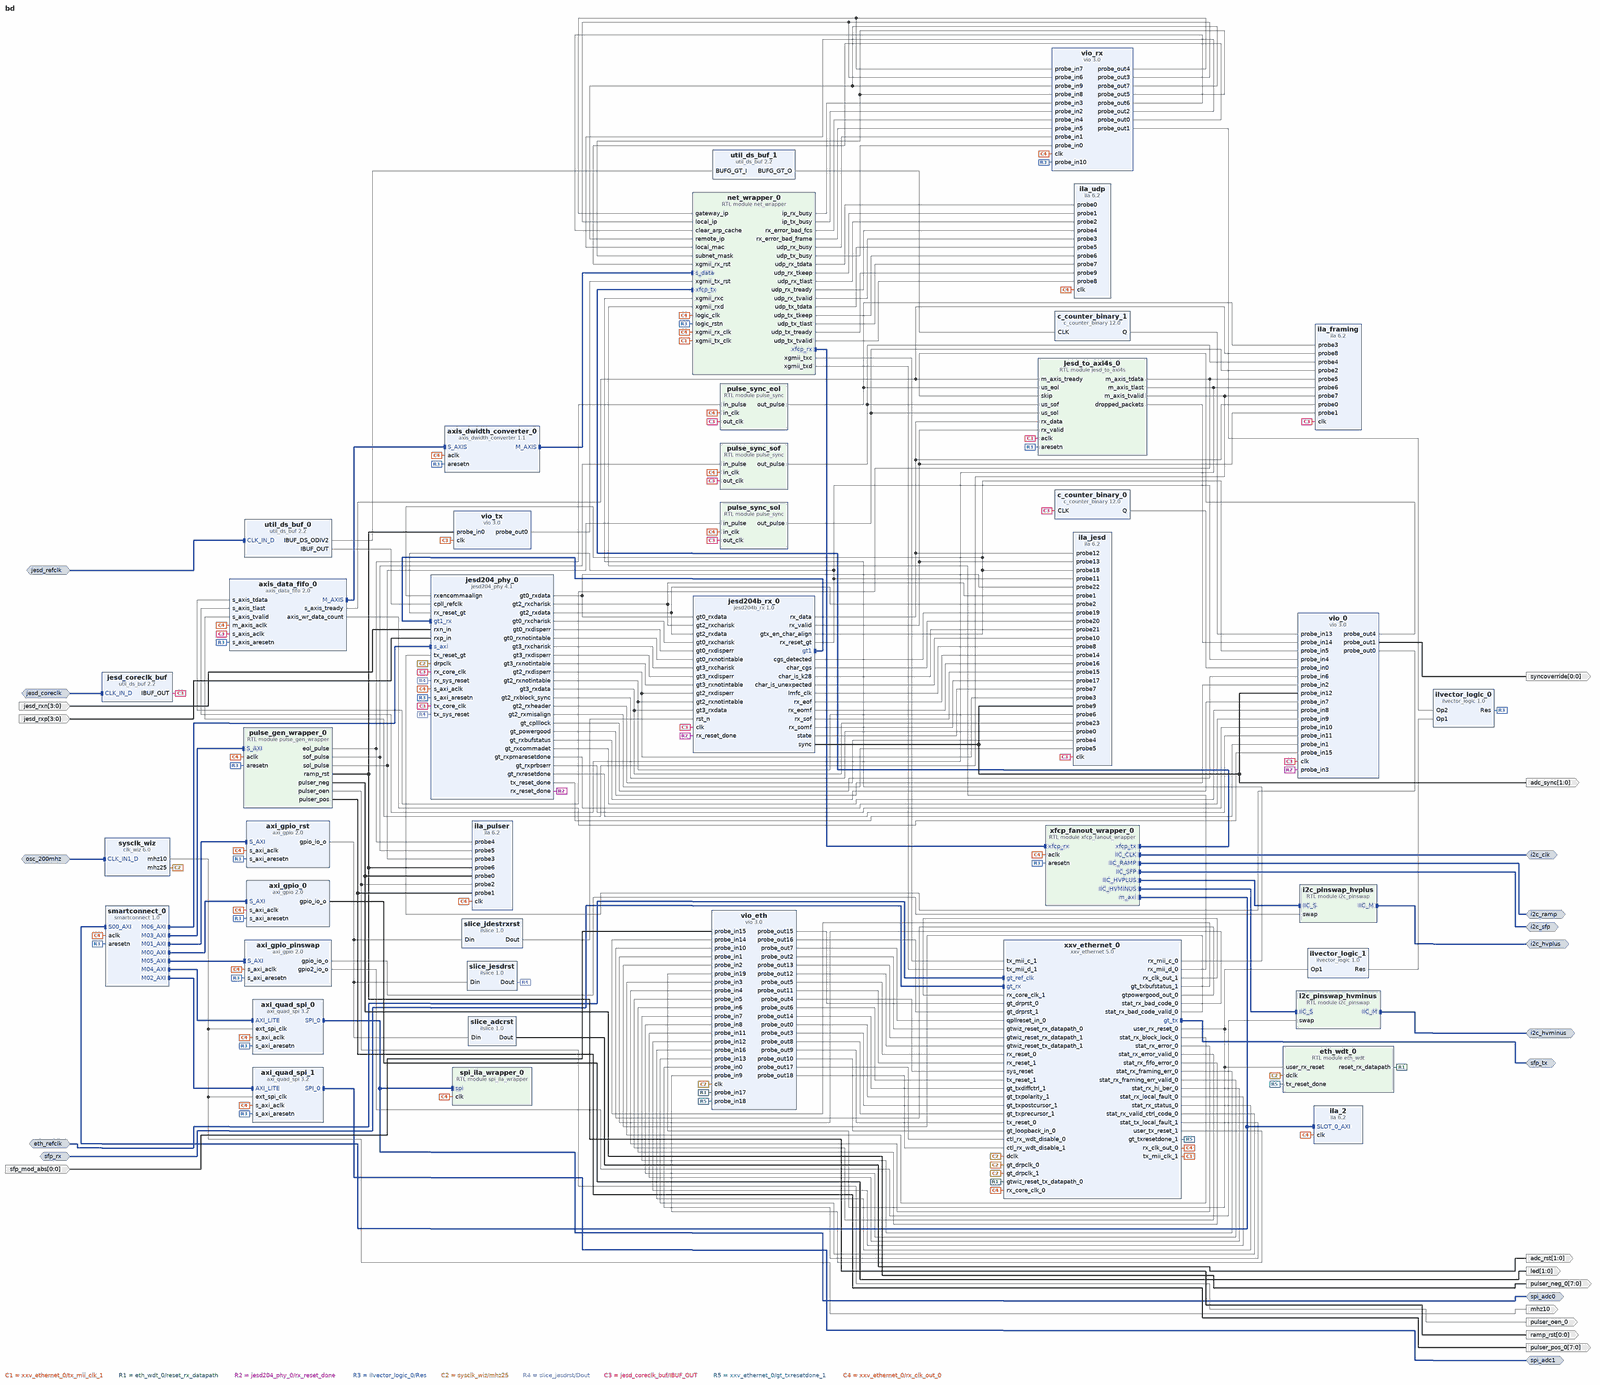
[diagram p0: block diagram of the top level, whole]
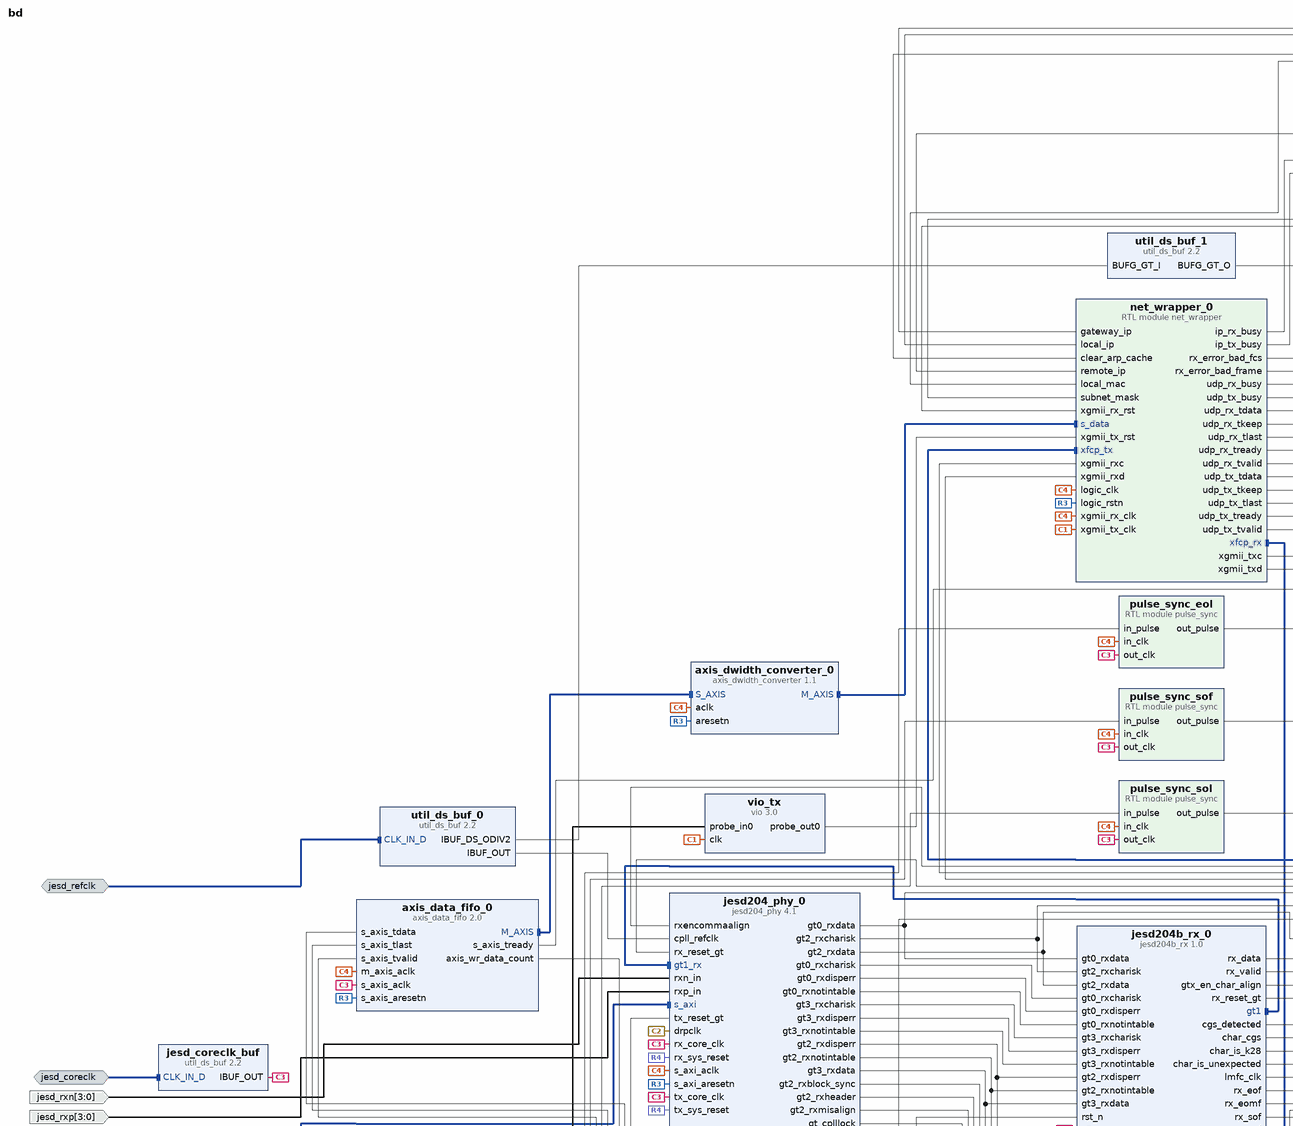
[diagram p1: block diagram of the top level, upper left part]
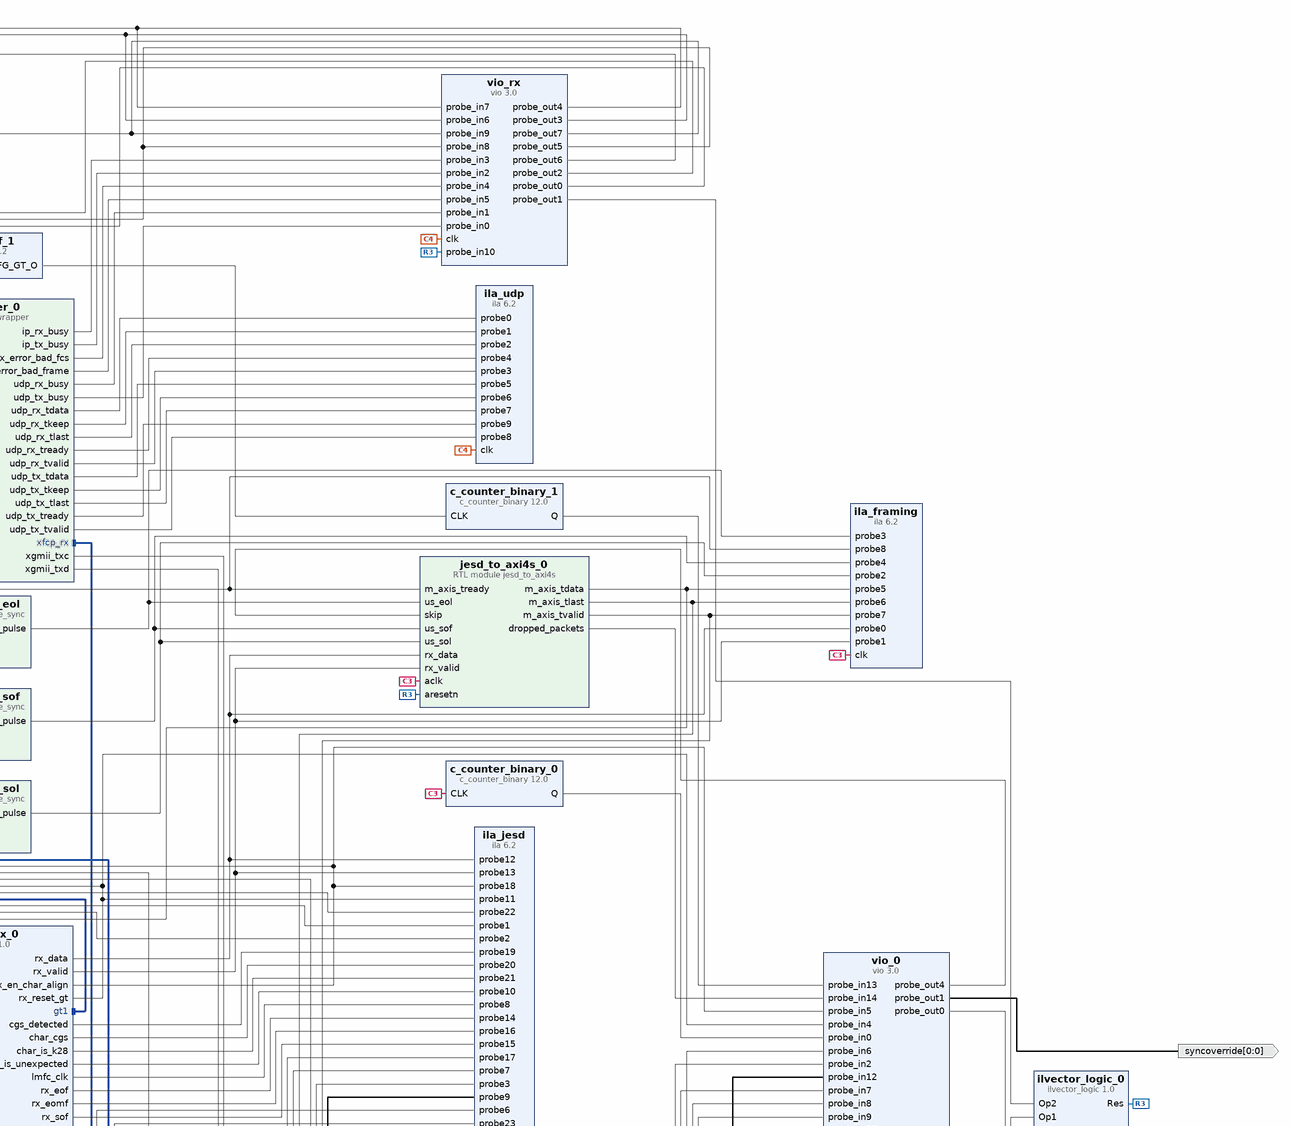
[diagram p2: block diagram of the top level, upper right part]
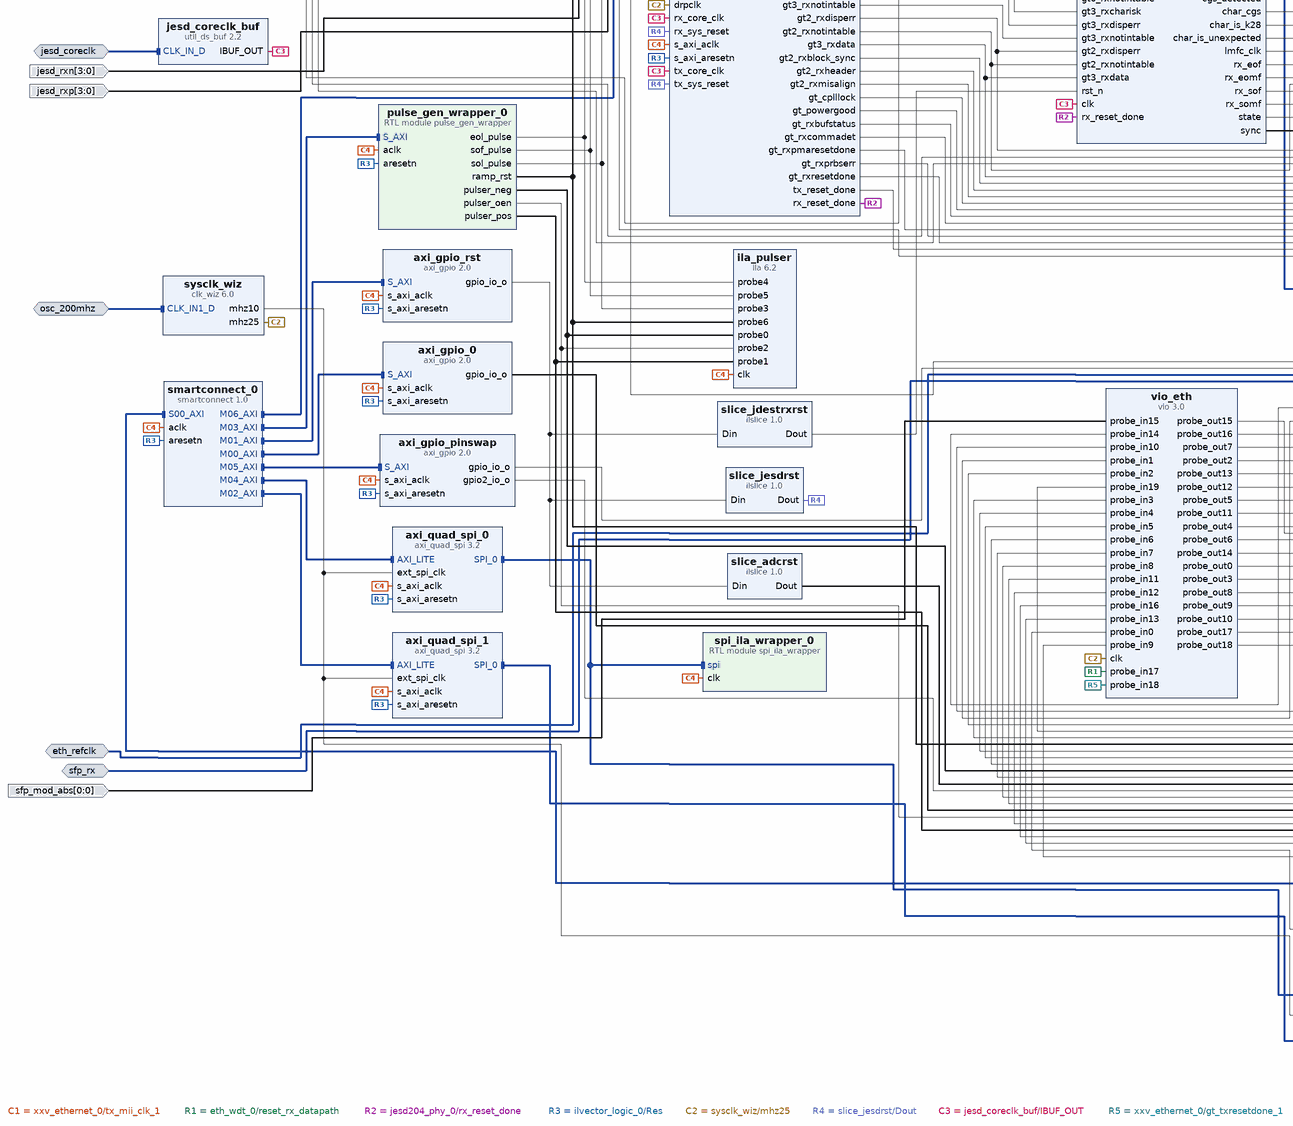
[diagram p3: block diagram of the top level, lower left part]
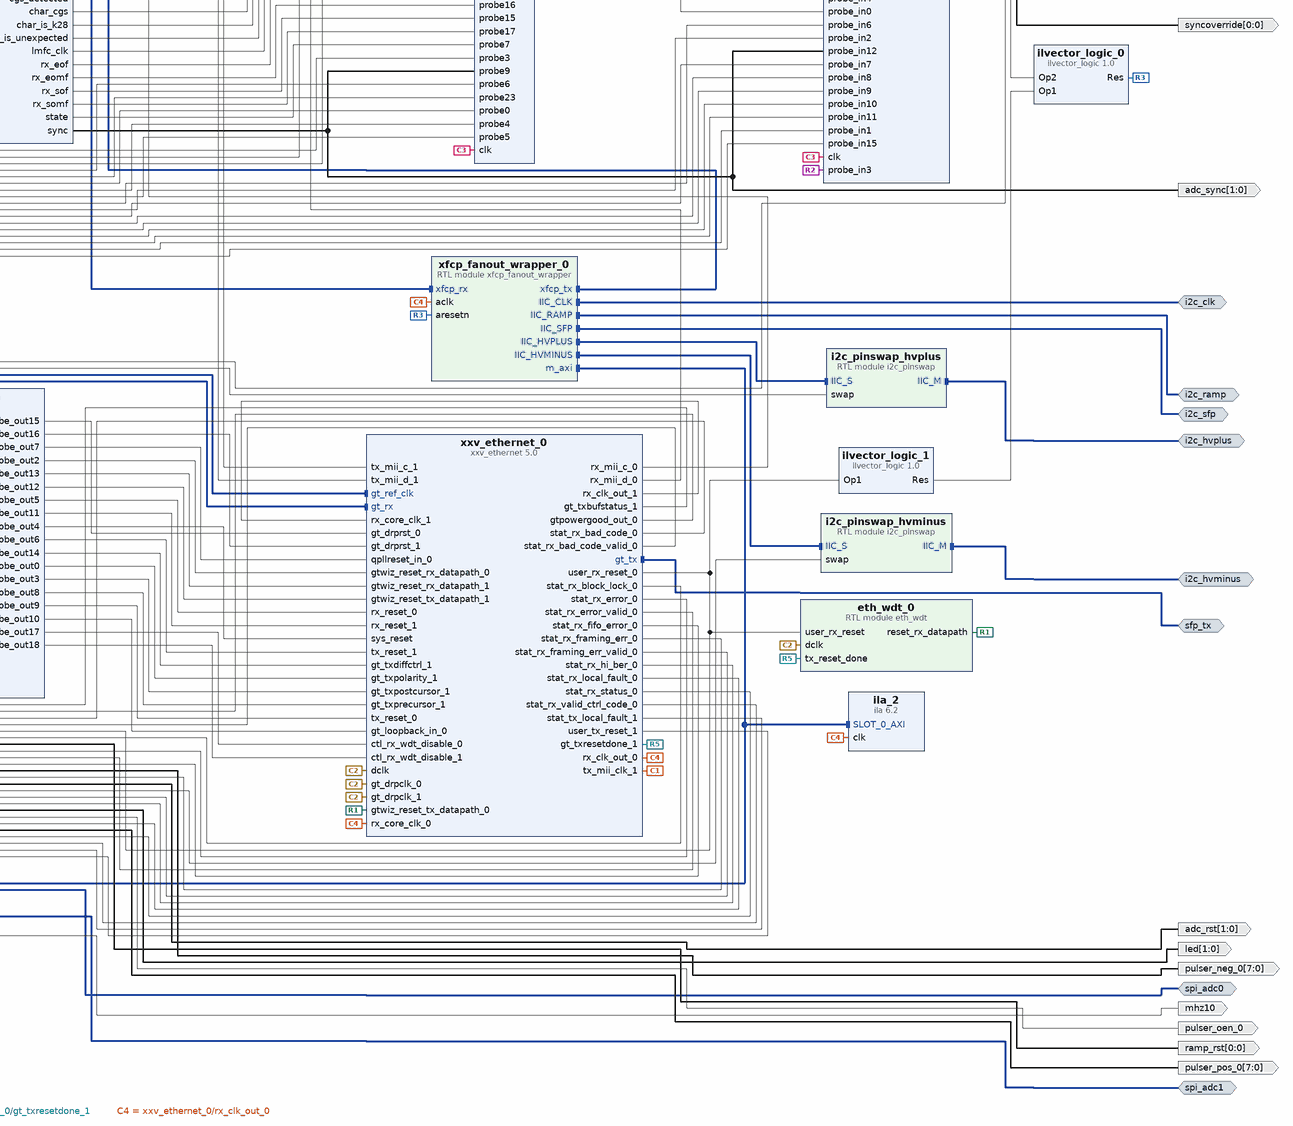
[diagram p4: block diagram of the top level, lower right part]
# Vivado block design bd, xcau15p-ffvb676-2-i, Vivado 2025.2.1
create_bd_design bd

create_bd_intf_port -mode Slave -vlnv xilinx.com:interface:diff_clock_rtl:1.0 eth_refclk
set_property -dict {CONFIG.FREQ_HZ 156250000} [get_bd_intf_ports eth_refclk]
create_bd_intf_port -mode Slave -vlnv xilinx.com:display_xxv_ethernet:gt_ports:2.0 sfp_rx
create_bd_intf_port -mode Master -vlnv xilinx.com:display_xxv_ethernet:gt_ports:2.0 sfp_tx
create_bd_intf_port -mode Slave -vlnv xilinx.com:interface:diff_clock_rtl:1.0 jesd_refclk
create_bd_intf_port -mode Slave -vlnv xilinx.com:interface:diff_clock_rtl:1.0 osc_200mhz
set_property -dict {CONFIG.FREQ_HZ 200000000} [get_bd_intf_ports osc_200mhz]
create_bd_intf_port -mode Slave -vlnv xilinx.com:interface:diff_clock_rtl:1.0 jesd_coreclk
create_bd_intf_port -mode Master -vlnv xilinx.com:interface:iic_rtl:1.0 i2c_hvplus
create_bd_intf_port -mode Master -vlnv xilinx.com:interface:iic_rtl:1.0 i2c_hvminus
create_bd_intf_port -mode Master -vlnv xilinx.com:interface:iic_rtl:1.0 i2c_clk
create_bd_intf_port -mode Master -vlnv xilinx.com:interface:iic_rtl:1.0 i2c_sfp
create_bd_intf_port -mode Master -vlnv xilinx.com:interface:iic_rtl:1.0 i2c_ramp
create_bd_intf_port -mode Master -vlnv xilinx.com:interface:spi_rtl:1.0 spi_adc0
create_bd_intf_port -mode Master -vlnv xilinx.com:interface:spi_rtl:1.0 spi_adc1
create_bd_port -dir I -from 3 -to 0 jesd_rxp
create_bd_port -dir I -from 3 -to 0 jesd_rxn
create_bd_port -dir I -from 0 -to 0 sfp_mod_abs
create_bd_port -dir O -from 1 -to 0 led
create_bd_port -dir O -from 0 -to 0 ramp_rst
create_bd_port -dir O -from 7 -to 0 pulser_pos_0
create_bd_port -dir O -from 7 -to 0 pulser_neg_0
create_bd_port -dir O pulser_oen_0
create_bd_port -dir O -from 1 -to 0 adc_sync
create_bd_port -dir O -from 1 -to 0 adc_rst
create_bd_port -dir O -type clk mhz10
create_bd_port -dir O -from 0 -to 0 syncoverride

create_bd_cell -type ip -vlnv xilinx.com:ip:xxv_ethernet:5.0 xxv_ethernet_0
set_property -dict [list \
  CONFIG.ADD_GT_CNTRL_STS_PORTS 1 \
  CONFIG.BASE_R_KR BASE-R \
  CONFIG.CORE {Ethernet PCS/PMA 64-bit} \
  CONFIG.DATA_PATH_INTERFACE MII \
  CONFIG.ENABLE_GT_BOARD_INTERFACE 0 \
  CONFIG.ENABLE_PIPELINE_REG 0 \
  CONFIG.GT_DRP_CLK 25 \
  CONFIG.INCLUDE_AXI4_INTERFACE 0 \
  CONFIG.LANE1_GT_LOC X0Y0 \
  CONFIG.NUM_OF_CORES 2 \
] [get_bd_cells xxv_ethernet_0]
create_bd_cell -type ip -vlnv xilinx.com:ip:jesd204_phy:4.1 jesd204_phy_0
set_property -dict [list \
  CONFIG.Axi_Lite true \
  CONFIG.C_LANES 4 \
  CONFIG.Config_Type 0 \
  CONFIG.DRPCLK_FREQ 25.0 \
  CONFIG.GT_Line_Rate 2 \
  CONFIG.GT_Location X0Y4 \
  CONFIG.GT_REFCLK_FREQ 100 \
  CONFIG.RX_GT_Line_Rate 2 \
  CONFIG.RX_GT_REFCLK_FREQ 100 \
  CONFIG.Rx_MasterChan 2 \
  CONFIG.TransceiverControl true \
] [get_bd_cells jesd204_phy_0]
create_bd_cell -type ip -vlnv xilinx.com:ip:util_ds_buf:2.2 util_ds_buf_0
set_property -dict {CONFIG.C_BUF_TYPE IBUFDSGTE} [get_bd_cells util_ds_buf_0]
create_bd_cell -type ip -vlnv xilinx.com:ip:util_ds_buf:2.2 jesd_coreclk_buf
set_property -dict {CONFIG.C_BUF_TYPE IBUFDS} [get_bd_cells jesd_coreclk_buf]
create_bd_cell -type ip -vlnv xilinx.com:ip:clk_wiz:6.0 sysclk_wiz
set_property -dict [list \
  CONFIG.AUTO_PRIMITIVE PLL \
  CONFIG.CLKIN1_JITTER_PS 50.0 \
  CONFIG.CLKOUT1_DRIVES Buffer \
  CONFIG.CLKOUT1_JITTER 151.619 \
  CONFIG.CLKOUT1_PHASE_ERROR 97.786 \
  CONFIG.CLKOUT1_REQUESTED_OUT_FREQ 25 \
  CONFIG.CLKOUT2_DRIVES Buffer \
  CONFIG.CLKOUT2_JITTER 181.846 \
  CONFIG.CLKOUT2_PHASE_ERROR 97.786 \
  CONFIG.CLKOUT2_REQUESTED_OUT_FREQ 10 \
  CONFIG.CLKOUT2_USED true \
  CONFIG.CLKOUT3_DRIVES Buffer \
  CONFIG.CLKOUT4_DRIVES Buffer \
  CONFIG.CLKOUT5_DRIVES Buffer \
  CONFIG.CLKOUT6_DRIVES Buffer \
  CONFIG.CLKOUT7_DRIVES Buffer \
  CONFIG.CLK_OUT1_PORT mhz25 \
  CONFIG.CLK_OUT2_PORT mhz10 \
  CONFIG.FEEDBACK_SOURCE FDBK_AUTO \
  CONFIG.MMCM_BANDWIDTH OPTIMIZED \
  CONFIG.MMCM_CLKFBOUT_MULT_F 4 \
  CONFIG.MMCM_CLKIN1_PERIOD 5.000 \
  CONFIG.MMCM_CLKIN2_PERIOD 10.0 \
  CONFIG.MMCM_CLKOUT0_DIVIDE_F 32 \
  CONFIG.MMCM_CLKOUT1_DIVIDE 80 \
  CONFIG.MMCM_COMPENSATION AUTO \
  CONFIG.MMCM_DIVCLK_DIVIDE 1 \
  CONFIG.NUM_OUT_CLKS 2 \
  CONFIG.OPTIMIZE_CLOCKING_STRUCTURE_EN true \
  CONFIG.PRIMITIVE Auto \
  CONFIG.PRIM_IN_FREQ 200 \
  CONFIG.PRIM_SOURCE Differential_clock_capable_pin \
  CONFIG.USE_LOCKED false \
  CONFIG.USE_RESET false \
] [get_bd_cells sysclk_wiz]
create_bd_cell -type ip -vlnv xilinx.com:ip:vio:3.0 vio_tx
set_property -dict [list \
  CONFIG.C_NUM_PROBE_IN 1 \
  CONFIG.C_NUM_PROBE_OUT 1 \
  CONFIG.C_PROBE_IN0_WIDTH 1 \
  CONFIG.C_PROBE_IN1_WIDTH 1 \
  CONFIG.C_PROBE_OUT0_WIDTH 1 \
  CONFIG.C_PROBE_OUT1_INIT_VAL 0x1 \
  CONFIG.C_PROBE_OUT2_WIDTH 8 \
  CONFIG.C_PROBE_OUT3_INIT_VAL 0x0 \
] [get_bd_cells vio_tx]
create_bd_cell -type ip -vlnv xilinx.com:ip:vio:3.0 vio_rx
set_property -dict [list \
  CONFIG.C_NUM_PROBE_IN 11 \
  CONFIG.C_NUM_PROBE_OUT 8 \
  CONFIG.C_PROBE_IN0_WIDTH 1 \
  CONFIG.C_PROBE_IN10_WIDTH 1 \
  CONFIG.C_PROBE_IN11_WIDTH 8 \
  CONFIG.C_PROBE_IN12_WIDTH 8 \
  CONFIG.C_PROBE_IN13_WIDTH 16 \
  CONFIG.C_PROBE_IN14_WIDTH 32 \
  CONFIG.C_PROBE_IN15_WIDTH 32 \
  CONFIG.C_PROBE_IN16_WIDTH 16 \
  CONFIG.C_PROBE_IN17_WIDTH 16 \
  CONFIG.C_PROBE_IN18_WIDTH 16 \
  CONFIG.C_PROBE_IN19_WIDTH 16 \
  CONFIG.C_PROBE_IN1_WIDTH 1 \
  CONFIG.C_PROBE_IN2_WIDTH 1 \
  CONFIG.C_PROBE_IN3_WIDTH 1 \
  CONFIG.C_PROBE_IN4_WIDTH 1 \
  CONFIG.C_PROBE_IN5_WIDTH 1 \
  CONFIG.C_PROBE_IN6_WIDTH 32 \
  CONFIG.C_PROBE_IN7_WIDTH 32 \
  CONFIG.C_PROBE_IN8_WIDTH 32 \
  CONFIG.C_PROBE_IN9_WIDTH 32 \
  CONFIG.C_PROBE_OUT0_WIDTH 1 \
  CONFIG.C_PROBE_OUT10_WIDTH 1 \
  CONFIG.C_PROBE_OUT11_WIDTH 16 \
  CONFIG.C_PROBE_OUT13_WIDTH 1 \
  CONFIG.C_PROBE_OUT1_INIT_VAL 0x1 \
  CONFIG.C_PROBE_OUT1_WIDTH 1 \
  CONFIG.C_PROBE_OUT2_INIT_VAL 0x020000000001 \
  CONFIG.C_PROBE_OUT2_WIDTH 48 \
  CONFIG.C_PROBE_OUT3_INIT_VAL 0x0a500401 \
  CONFIG.C_PROBE_OUT3_WIDTH 32 \
  CONFIG.C_PROBE_OUT4_INIT_VAL 0x00000000 \
  CONFIG.C_PROBE_OUT4_WIDTH 32 \
  CONFIG.C_PROBE_OUT5_INIT_VAL 0x00000000 \
  CONFIG.C_PROBE_OUT5_WIDTH 32 \
  CONFIG.C_PROBE_OUT6_WIDTH 1 \
  CONFIG.C_PROBE_OUT7_INIT_VAL 0x0a500402 \
  CONFIG.C_PROBE_OUT7_WIDTH 32 \
  CONFIG.C_PROBE_OUT8_WIDTH 16 \
  CONFIG.C_PROBE_OUT9_WIDTH 16 \
] [get_bd_cells vio_rx]
create_bd_cell -type ip -vlnv xilinx.com:ip:vio:3.0 vio_eth
set_property -dict [list \
  CONFIG.C_NUM_PROBE_IN 20 \
  CONFIG.C_NUM_PROBE_OUT 19 \
  CONFIG.C_PROBE_IN17_WIDTH 16 \
  CONFIG.C_PROBE_IN18_WIDTH 16 \
  CONFIG.C_PROBE_IN20_WIDTH 2 \
  CONFIG.C_PROBE_IN4_WIDTH 8 \
  CONFIG.C_PROBE_OUT0_INIT_VAL 0x1 \
  CONFIG.C_PROBE_OUT10_WIDTH 3 \
  CONFIG.C_PROBE_OUT11_INIT_VAL 0x0 \
  CONFIG.C_PROBE_OUT11_WIDTH 1 \
  CONFIG.C_PROBE_OUT12_INIT_VAL 0x0 \
  CONFIG.C_PROBE_OUT12_WIDTH 1 \
  CONFIG.C_PROBE_OUT13_INIT_VAL 0x1 \
  CONFIG.C_PROBE_OUT13_WIDTH 1 \
  CONFIG.C_PROBE_OUT14_INIT_VAL 0x10 \
  CONFIG.C_PROBE_OUT14_WIDTH 5 \
  CONFIG.C_PROBE_OUT17_INIT_VAL 0x1 \
  CONFIG.C_PROBE_OUT1_INIT_VAL 0x1 \
  CONFIG.C_PROBE_OUT3_WIDTH 5 \
  CONFIG.C_PROBE_OUT8_WIDTH 5 \
  CONFIG.C_PROBE_OUT9_INIT_VAL 0x1 \
] [get_bd_cells vio_eth]
create_bd_cell -type module -reference net_wrapper net_wrapper_0
create_bd_cell -type ip -vlnv xilinx.com:ip:axi_gpio:2.0 axi_gpio_0
set_property -dict {CONFIG.C_ALL_OUTPUTS 1 CONFIG.C_GPIO_WIDTH 2} [get_bd_cells axi_gpio_0]
create_bd_cell -type ip -vlnv xilinx.com:ip:smartconnect:1.0 smartconnect_0
set_property -dict {CONFIG.NUM_MI 7 CONFIG.NUM_SI 1} [get_bd_cells smartconnect_0]
create_bd_cell -type ip -vlnv xilinx.com:ip:ila:6.2 ila_2
create_bd_cell -type module -reference xfcp_fanout_wrapper xfcp_fanout_wrapper_0
create_bd_cell -type ip -vlnv xilinx.com:ip:axi_gpio:2.0 axi_gpio_rst
set_property -dict {CONFIG.C_ALL_OUTPUTS 1 CONFIG.C_DOUT_DEFAULT 0x00000008 CONFIG.C_GPIO_WIDTH 4} [get_bd_cells axi_gpio_rst]
create_bd_cell -type module -reference pulse_gen_wrapper pulse_gen_wrapper_0
create_bd_cell -type ip -vlnv xilinx.com:user:jesd204b_rx:1.0 jesd204b_rx_0
set_property -dict {CONFIG.DATA_WIDTH 32 CONFIG.K 9 CONFIG.L 4 CONFIG.LINKS 2} [get_bd_cells jesd204b_rx_0]
create_bd_cell -type ip -vlnv xilinx.com:ip:c_counter_binary:12.0 c_counter_binary_0
set_property -dict {CONFIG.Output_Width 32} [get_bd_cells c_counter_binary_0]
create_bd_cell -type ip -vlnv xilinx.com:ip:vio:3.0 vio_0
set_property -dict [list \
  CONFIG.C_NUM_PROBE_IN 16 \
  CONFIG.C_NUM_PROBE_OUT 5 \
  CONFIG.C_PROBE_IN0_WIDTH 32 \
  CONFIG.C_PROBE_IN10_WIDTH 4 \
  CONFIG.C_PROBE_IN11_WIDTH 4 \
  CONFIG.C_PROBE_IN12_WIDTH 2 \
  CONFIG.C_PROBE_IN13_WIDTH 32 \
  CONFIG.C_PROBE_IN14_WIDTH 32 \
  CONFIG.C_PROBE_IN15_WIDTH 32 \
  CONFIG.C_PROBE_IN4_WIDTH 1 \
  CONFIG.C_PROBE_IN6_WIDTH 4 \
  CONFIG.C_PROBE_IN7_WIDTH 12 \
  CONFIG.C_PROBE_IN8_WIDTH 4 \
  CONFIG.C_PROBE_IN9_WIDTH 4 \
  CONFIG.C_PROBE_OUT4_INIT_VAL 0x00 \
  CONFIG.C_PROBE_OUT4_WIDTH 8 \
  CONFIG.C_PROBE_OUT6_INIT_VAL 0xf \
  CONFIG.C_PROBE_OUT6_WIDTH 4 \
] [get_bd_cells vio_0]
create_bd_cell -type ip -vlnv xilinx.com:ip:axi_quad_spi:3.2 axi_quad_spi_0
create_bd_cell -type ip -vlnv xilinx.com:ip:axi_quad_spi:3.2 axi_quad_spi_1
create_bd_cell -type ip -vlnv xilinx.com:ip:ila:6.2 ila_jesd
set_property -dict [list \
  CONFIG.C_MONITOR_TYPE Native \
  CONFIG.C_NUM_OF_PROBES 24 \
  CONFIG.C_PROBE10_WIDTH 16 \
  CONFIG.C_PROBE12_WIDTH 128 \
  CONFIG.C_PROBE14_WIDTH 4 \
  CONFIG.C_PROBE15_WIDTH 4 \
  CONFIG.C_PROBE16_WIDTH 4 \
  CONFIG.C_PROBE17_WIDTH 4 \
  CONFIG.C_PROBE19_WIDTH 4 \
  CONFIG.C_PROBE1_WIDTH 4 \
  CONFIG.C_PROBE20_WIDTH 16 \
  CONFIG.C_PROBE21_WIDTH 16 \
  CONFIG.C_PROBE22_WIDTH 32 \
  CONFIG.C_PROBE23_WIDTH 32 \
  CONFIG.C_PROBE2_WIDTH 64 \
  CONFIG.C_PROBE3_WIDTH 4 \
  CONFIG.C_PROBE4_WIDTH 2 \
  CONFIG.C_PROBE6_WIDTH 4 \
  CONFIG.C_PROBE7_WIDTH 2 \
  CONFIG.C_PROBE8_WIDTH 1 \
  CONFIG.C_PROBE9_WIDTH 2 \
] [get_bd_cells ila_jesd]
create_bd_cell -type module -reference i2c_pinswap i2c_pinswap_hvplus
create_bd_cell -type module -reference i2c_pinswap i2c_pinswap_hvminus
create_bd_cell -type ip -vlnv xilinx.com:ip:axi_gpio:2.0 axi_gpio_pinswap
set_property -dict [list \
  CONFIG.C_ALL_OUTPUTS 1 \
  CONFIG.C_ALL_OUTPUTS_2 1 \
  CONFIG.C_GPIO2_WIDTH 1 \
  CONFIG.C_GPIO_WIDTH 1 \
  CONFIG.C_IS_DUAL 1 \
] [get_bd_cells axi_gpio_pinswap]
create_bd_cell -type inline_hdl -vlnv xilinx.com:inline_hdl:ilvector_logic:1.0 ilvector_logic_0
set_property -dict {CONFIG.C_OPERATION and CONFIG.C_SIZE 1} [get_bd_cells ilvector_logic_0]
create_bd_cell -type inline_hdl -vlnv xilinx.com:inline_hdl:ilvector_logic:1.0 ilvector_logic_1
set_property -dict {CONFIG.C_OPERATION not CONFIG.C_SIZE 1} [get_bd_cells ilvector_logic_1]
create_bd_cell -type module -reference eth_wdt eth_wdt_0
create_bd_cell -type ip -vlnv xilinx.com:ip:util_ds_buf:2.2 util_ds_buf_1
set_property -dict {CONFIG.C_BUF_TYPE BUFG_GT} [get_bd_cells util_ds_buf_1]
create_bd_cell -type ip -vlnv xilinx.com:ip:c_counter_binary:12.0 c_counter_binary_1
set_property -dict {CONFIG.Output_Width 32} [get_bd_cells c_counter_binary_1]
create_bd_cell -type inline_hdl -vlnv xilinx.com:inline_hdl:ilslice:1.0 slice_adcrst
set_property -dict {CONFIG.DIN_FROM 1 CONFIG.DIN_WIDTH 4} [get_bd_cells slice_adcrst]
create_bd_cell -type inline_hdl -vlnv xilinx.com:inline_hdl:ilslice:1.0 slice_jesdrst
set_property -dict {CONFIG.DIN_FROM 2 CONFIG.DIN_TO 2 CONFIG.DIN_WIDTH 4} [get_bd_cells slice_jesdrst]
create_bd_cell -type module -reference spi_ila_wrapper spi_ila_wrapper_0
create_bd_cell -type ip -vlnv xilinx.com:ip:axis_data_fifo:2.0 axis_data_fifo_0
set_property -dict [list \
  CONFIG.FIFO_DEPTH 1024 \
  CONFIG.HAS_RD_DATA_COUNT 0 \
  CONFIG.HAS_TKEEP 0 \
  CONFIG.HAS_WR_DATA_COUNT 1 \
  CONFIG.IS_ACLK_ASYNC 1 \
] [get_bd_cells axis_data_fifo_0]
create_bd_cell -type module -reference jesd_to_axi4s jesd_to_axi4s_0
set_property -dict {CONFIG.FRAMES_PER_PACKET 80} [get_bd_cells jesd_to_axi4s_0]
create_bd_cell -type ip -vlnv xilinx.com:ip:ila:6.2 ila_udp
set_property -dict [list \
  CONFIG.C_MONITOR_TYPE Native \
  CONFIG.C_NUM_OF_PROBES 10 \
  CONFIG.C_PROBE0_WIDTH 64 \
  CONFIG.C_PROBE1_WIDTH 8 \
  CONFIG.C_PROBE5_WIDTH 64 \
  CONFIG.C_PROBE6_WIDTH 8 \
] [get_bd_cells ila_udp]
create_bd_cell -type ip -vlnv xilinx.com:ip:axis_dwidth_converter:1.1 axis_dwidth_converter_0
set_property -dict {CONFIG.M_TDATA_NUM_BYTES 8} [get_bd_cells axis_dwidth_converter_0]
create_bd_cell -type inline_hdl -vlnv xilinx.com:inline_hdl:ilslice:1.0 slice_jdestrxrst
set_property -dict {CONFIG.DIN_FROM 3 CONFIG.DIN_TO 3 CONFIG.DIN_WIDTH 4} [get_bd_cells slice_jdestrxrst]
create_bd_cell -type module -reference pulse_sync pulse_sync_sol
create_bd_cell -type module -reference pulse_sync pulse_sync_sof
create_bd_cell -type module -reference pulse_sync pulse_sync_eol
create_bd_cell -type ip -vlnv xilinx.com:ip:ila:6.2 ila_framing
set_property -dict [list \
  CONFIG.C_MONITOR_TYPE Native \
  CONFIG.C_NUM_OF_PROBES 9 \
  CONFIG.C_PROBE0_WIDTH 128 \
  CONFIG.C_PROBE5_WIDTH 128 \
] [get_bd_cells ila_framing]
create_bd_cell -type ip -vlnv xilinx.com:ip:ila:6.2 ila_pulser
set_property -dict [list \
  CONFIG.C_ADV_TRIGGER true \
  CONFIG.C_EN_STRG_QUAL 1 \
  CONFIG.C_MONITOR_TYPE Native \
  CONFIG.C_NUM_OF_PROBES 7 \
  CONFIG.C_PROBE0_WIDTH 8 \
  CONFIG.C_PROBE1_WIDTH 8 \
] [get_bd_cells ila_pulser]

# ---- connections ----

connect_bd_intf_net -intf_net CLK_IN1_D_0_1 [get_bd_intf_ports osc_200mhz] [get_bd_intf_pins sysclk_wiz/CLK_IN1_D]
connect_bd_intf_net -intf_net CLK_IN_D_0_1 [get_bd_intf_ports jesd_refclk] [get_bd_intf_pins util_ds_buf_0/CLK_IN_D]
connect_bd_intf_net -intf_net CLK_IN_D_0_2 [get_bd_intf_ports jesd_coreclk] [get_bd_intf_pins jesd_coreclk_buf/CLK_IN_D]
connect_bd_intf_net [get_bd_intf_ports spi_adc0] [get_bd_intf_pins axi_quad_spi_0/SPI_0]
connect_bd_intf_net [get_bd_intf_ports spi_adc0] [get_bd_intf_pins spi_ila_wrapper_0/spi]
connect_bd_intf_net [get_bd_intf_ports spi_adc1] [get_bd_intf_pins axi_quad_spi_1/SPI_0]
connect_bd_intf_net [get_bd_intf_pins axis_dwidth_converter_0/S_AXIS] [get_bd_intf_pins axis_data_fifo_0/M_AXIS]
connect_bd_intf_net [get_bd_intf_pins axis_dwidth_converter_0/M_AXIS] [get_bd_intf_pins net_wrapper_0/s_data]
connect_bd_intf_net -intf_net gt_ref_clk_0_1 [get_bd_intf_ports eth_refclk] [get_bd_intf_pins xxv_ethernet_0/gt_ref_clk]
connect_bd_intf_net -intf_net gt_rx_0_1 [get_bd_intf_ports sfp_rx] [get_bd_intf_pins xxv_ethernet_0/gt_rx]
connect_bd_intf_net -intf_net i2c_pinswap_0_IIC_M [get_bd_intf_ports i2c_hvplus] [get_bd_intf_pins i2c_pinswap_hvplus/IIC_M]
connect_bd_intf_net -intf_net i2c_pinswap_1_IIC_M [get_bd_intf_ports i2c_hvminus] [get_bd_intf_pins i2c_pinswap_hvminus/IIC_M]
connect_bd_intf_net [get_bd_intf_pins jesd204b_rx_0/gt1] [get_bd_intf_pins jesd204_phy_0/gt1_rx]
connect_bd_intf_net [get_bd_intf_pins net_wrapper_0/xfcp_rx] [get_bd_intf_pins xfcp_fanout_wrapper_0/xfcp_rx]
connect_bd_intf_net [get_bd_intf_pins smartconnect_0/M00_AXI] [get_bd_intf_pins axi_gpio_0/S_AXI]
connect_bd_intf_net [get_bd_intf_pins smartconnect_0/M01_AXI] [get_bd_intf_pins axi_gpio_rst/S_AXI]
connect_bd_intf_net [get_bd_intf_pins axi_quad_spi_1/AXI_LITE] [get_bd_intf_pins smartconnect_0/M02_AXI]
connect_bd_intf_net [get_bd_intf_pins pulse_gen_wrapper_0/S_AXI] [get_bd_intf_pins smartconnect_0/M03_AXI]
connect_bd_intf_net [get_bd_intf_pins smartconnect_0/M04_AXI] [get_bd_intf_pins axi_quad_spi_0/AXI_LITE]
connect_bd_intf_net [get_bd_intf_pins smartconnect_0/M05_AXI] [get_bd_intf_pins axi_gpio_pinswap/S_AXI]
connect_bd_intf_net [get_bd_intf_pins smartconnect_0/M06_AXI] [get_bd_intf_pins jesd204_phy_0/s_axi]
connect_bd_intf_net [get_bd_intf_ports i2c_clk] [get_bd_intf_pins xfcp_fanout_wrapper_0/IIC_CLK]
connect_bd_intf_net [get_bd_intf_pins i2c_pinswap_hvminus/IIC_S] [get_bd_intf_pins xfcp_fanout_wrapper_0/IIC_HVMINUS]
connect_bd_intf_net [get_bd_intf_pins i2c_pinswap_hvplus/IIC_S] [get_bd_intf_pins xfcp_fanout_wrapper_0/IIC_HVPLUS]
connect_bd_intf_net [get_bd_intf_ports i2c_ramp] [get_bd_intf_pins xfcp_fanout_wrapper_0/IIC_RAMP]
connect_bd_intf_net [get_bd_intf_ports i2c_sfp] [get_bd_intf_pins xfcp_fanout_wrapper_0/IIC_SFP]
connect_bd_intf_net [get_bd_intf_pins smartconnect_0/S00_AXI] [get_bd_intf_pins xfcp_fanout_wrapper_0/m_axi]
connect_bd_intf_net [get_bd_intf_pins smartconnect_0/S00_AXI] [get_bd_intf_pins ila_2/SLOT_0_AXI]
connect_bd_intf_net [get_bd_intf_pins net_wrapper_0/xfcp_tx] [get_bd_intf_pins xfcp_fanout_wrapper_0/xfcp_tx]
connect_bd_intf_net [get_bd_intf_ports sfp_tx] [get_bd_intf_pins xxv_ethernet_0/gt_tx]
connect_bd_net [get_bd_pins xxv_ethernet_0/tx_mii_clk_1] [get_bd_pins vio_tx/clk] [get_bd_pins net_wrapper_0/xgmii_tx_clk]
connect_bd_net [get_bd_pins axi_gpio_0/gpio_io_o] [get_bd_ports led]
connect_bd_net [get_bd_pins axi_gpio_pinswap/gpio2_io_o] [get_bd_pins i2c_pinswap_hvminus/swap]
connect_bd_net [get_bd_pins axi_gpio_pinswap/gpio_io_o] [get_bd_pins i2c_pinswap_hvplus/swap]
connect_bd_net -net axi_gpio_ramp_rst_gpio_io_o [get_bd_pins pulse_gen_wrapper_0/ramp_rst] \
  [get_bd_ports ramp_rst] [get_bd_pins vio_tx/probe_in0] [get_bd_pins ila_pulser/probe6]
connect_bd_net [get_bd_pins axi_gpio_rst/gpio_io_o] [get_bd_pins slice_adcrst/Din] [get_bd_pins slice_jesdrst/Din] [get_bd_pins slice_jdestrxrst/Din]
connect_bd_net [get_bd_pins axis_data_fifo_0/axis_wr_data_count] [get_bd_pins vio_0/probe_in15]
connect_bd_net [get_bd_pins axis_data_fifo_0/s_axis_tready] [get_bd_pins ila_framing/probe8] [get_bd_pins jesd_to_axi4s_0/m_axis_tready]
connect_bd_net [get_bd_pins c_counter_binary_0/Q] [get_bd_pins vio_0/probe_in0]
connect_bd_net [get_bd_pins c_counter_binary_1/Q] [get_bd_pins vio_0/probe_in13]
connect_bd_net -net clear_arp_cache [get_bd_pins vio_rx/probe_out6] [get_bd_pins net_wrapper_0/clear_arp_cache]
connect_bd_net -net drprst0 [get_bd_pins vio_eth/probe_out15] [get_bd_pins xxv_ethernet_0/gt_drprst_0]
connect_bd_net -net drprst1 [get_bd_pins vio_eth/probe_out16] [get_bd_pins xxv_ethernet_0/gt_drprst_1]
connect_bd_net [get_bd_pins eth_wdt_0/reset_rx_datapath] [get_bd_pins xxv_ethernet_0/gtwiz_reset_tx_datapath_0] [get_bd_pins vio_eth/probe_in17]
connect_bd_net -net ext_logic_rstn [get_bd_pins vio_rx/probe_out1] [get_bd_pins ilvector_logic_0/Op2]
connect_bd_net -net gateway_ip [get_bd_pins vio_rx/probe_out4] [get_bd_pins vio_rx/probe_in7] [get_bd_pins net_wrapper_0/gateway_ip]
connect_bd_net [get_bd_pins ilvector_logic_1/Res] [get_bd_pins ilvector_logic_0/Op1]
connect_bd_net [get_bd_pins jesd204_phy_0/gt0_rxcharisk] [get_bd_pins jesd204b_rx_0/gt0_rxcharisk]
connect_bd_net [get_bd_pins jesd204_phy_0/gt0_rxdata] [get_bd_pins jesd204b_rx_0/gt0_rxdata] [get_bd_pins ila_jesd/probe22]
connect_bd_net [get_bd_pins jesd204_phy_0/gt0_rxdisperr] [get_bd_pins jesd204b_rx_0/gt0_rxdisperr]
connect_bd_net [get_bd_pins jesd204_phy_0/gt0_rxnotintable] [get_bd_pins jesd204b_rx_0/gt0_rxnotintable]
connect_bd_net [get_bd_pins jesd204_phy_0/gt2_rxblock_sync] [get_bd_pins ila_jesd/probe0]
connect_bd_net [get_bd_pins jesd204_phy_0/gt2_rxcharisk] [get_bd_pins jesd204b_rx_0/gt2_rxcharisk] [get_bd_pins ila_jesd/probe1]
connect_bd_net [get_bd_pins jesd204_phy_0/gt2_rxdata] [get_bd_pins jesd204b_rx_0/gt2_rxdata] [get_bd_pins ila_jesd/probe2]
connect_bd_net [get_bd_pins jesd204_phy_0/gt2_rxdisperr] [get_bd_pins jesd204b_rx_0/gt2_rxdisperr] [get_bd_pins ila_jesd/probe3]
connect_bd_net [get_bd_pins jesd204_phy_0/gt2_rxheader] [get_bd_pins ila_jesd/probe4]
connect_bd_net [get_bd_pins jesd204_phy_0/gt2_rxmisalign] [get_bd_pins ila_jesd/probe5]
connect_bd_net [get_bd_pins jesd204_phy_0/gt2_rxnotintable] [get_bd_pins jesd204b_rx_0/gt2_rxnotintable] [get_bd_pins ila_jesd/probe6]
connect_bd_net [get_bd_pins jesd204_phy_0/gt3_rxcharisk] [get_bd_pins jesd204b_rx_0/gt3_rxcharisk]
connect_bd_net [get_bd_pins jesd204_phy_0/gt3_rxdata] [get_bd_pins jesd204b_rx_0/gt3_rxdata] [get_bd_pins ila_jesd/probe23]
connect_bd_net [get_bd_pins jesd204_phy_0/gt3_rxdisperr] [get_bd_pins jesd204b_rx_0/gt3_rxdisperr]
connect_bd_net [get_bd_pins jesd204_phy_0/gt3_rxnotintable] [get_bd_pins jesd204b_rx_0/gt3_rxnotintable]
connect_bd_net [get_bd_pins jesd204_phy_0/gt_cplllock] [get_bd_pins vio_0/probe_in6]
connect_bd_net [get_bd_pins jesd204_phy_0/gt_powergood] [get_bd_pins vio_0/probe_in2]
connect_bd_net [get_bd_pins jesd204_phy_0/gt_rxbufstatus] [get_bd_pins vio_0/probe_in7]
connect_bd_net [get_bd_pins jesd204_phy_0/gt_rxcommadet] [get_bd_pins vio_0/probe_in8]
connect_bd_net [get_bd_pins jesd204_phy_0/gt_rxpmaresetdone] [get_bd_pins vio_0/probe_in9]
connect_bd_net [get_bd_pins jesd204_phy_0/gt_rxprbserr] [get_bd_pins vio_0/probe_in10]
connect_bd_net [get_bd_pins jesd204_phy_0/gt_rxresetdone] [get_bd_pins vio_0/probe_in11]
connect_bd_net [get_bd_pins jesd204_phy_0/rx_reset_done] [get_bd_pins vio_0/probe_in3] [get_bd_pins jesd204b_rx_0/rx_reset_done]
connect_bd_net [get_bd_pins jesd204_phy_0/tx_reset_done] [get_bd_pins vio_0/probe_in1]
connect_bd_net [get_bd_pins jesd204b_rx_0/cgs_detected] [get_bd_pins ila_jesd/probe19]
connect_bd_net [get_bd_pins jesd204b_rx_0/char_cgs] [get_bd_pins ila_jesd/probe20]
connect_bd_net [get_bd_pins jesd204b_rx_0/char_is_k28] [get_bd_pins ila_jesd/probe21]
connect_bd_net [get_bd_pins jesd204b_rx_0/char_is_unexpected] [get_bd_pins ila_jesd/probe10]
connect_bd_net [get_bd_pins jesd204b_rx_0/gtx_en_char_align] \
  [get_bd_pins jesd204_phy_0/rxencommaalign] [get_bd_pins vio_0/probe_in5] [get_bd_pins ila_jesd/probe18]
connect_bd_net [get_bd_pins jesd204b_rx_0/lmfc_clk] [get_bd_pins ila_jesd/probe8]
connect_bd_net [get_bd_pins jesd204b_rx_0/rx_data] \
  [get_bd_pins ila_jesd/probe12] [get_bd_pins ila_framing/probe0] [get_bd_pins jesd_to_axi4s_0/rx_data]
connect_bd_net [get_bd_pins jesd204b_rx_0/rx_eof] [get_bd_pins ila_jesd/probe14]
connect_bd_net [get_bd_pins jesd204b_rx_0/rx_eomf] [get_bd_pins ila_jesd/probe16]
connect_bd_net [get_bd_pins jesd204b_rx_0/rx_sof] [get_bd_pins ila_jesd/probe15]
connect_bd_net [get_bd_pins jesd204b_rx_0/rx_somf] [get_bd_pins ila_jesd/probe17]
connect_bd_net [get_bd_pins jesd204b_rx_0/rx_valid] \
  [get_bd_pins ila_jesd/probe13] [get_bd_pins ila_framing/probe1] [get_bd_pins jesd_to_axi4s_0/rx_valid]
connect_bd_net [get_bd_pins jesd204b_rx_0/state] [get_bd_pins ila_jesd/probe7]
connect_bd_net [get_bd_pins jesd204b_rx_0/sync] [get_bd_pins vio_0/probe_in12] [get_bd_ports adc_sync] [get_bd_pins ila_jesd/probe9]
connect_bd_net [get_bd_pins jesd_to_axi4s_0/dropped_packets] [get_bd_pins vio_0/probe_in14]
connect_bd_net [get_bd_pins jesd_to_axi4s_0/m_axis_tdata] [get_bd_pins axis_data_fifo_0/s_axis_tdata] [get_bd_pins ila_framing/probe5]
connect_bd_net [get_bd_pins jesd_to_axi4s_0/m_axis_tlast] [get_bd_pins axis_data_fifo_0/s_axis_tlast] [get_bd_pins ila_framing/probe6]
connect_bd_net [get_bd_pins jesd_to_axi4s_0/m_axis_tvalid] [get_bd_pins axis_data_fifo_0/s_axis_tvalid] [get_bd_pins ila_framing/probe7]
connect_bd_net -net local_ip [get_bd_pins vio_rx/probe_out3] [get_bd_pins vio_rx/probe_in6] [get_bd_pins net_wrapper_0/local_ip]
connect_bd_net -net local_mac [get_bd_pins vio_rx/probe_out2] [get_bd_pins net_wrapper_0/local_mac]
connect_bd_net -net logic_rstn [get_bd_pins ilvector_logic_0/Res] \
  [get_bd_pins axi_gpio_0/s_axi_aresetn] [get_bd_pins xfcp_fanout_wrapper_0/aresetn] [get_bd_pins axi_gpio_rst/s_axi_aresetn] \
  [get_bd_pins axi_quad_spi_0/s_axi_aresetn] [get_bd_pins axi_quad_spi_1/s_axi_aresetn] [get_bd_pins vio_rx/probe_in10] \
  [get_bd_pins smartconnect_0/aresetn] [get_bd_pins axi_gpio_pinswap/s_axi_aresetn] \
  [get_bd_pins axis_data_fifo_0/s_axis_aresetn] [get_bd_pins jesd204_phy_0/s_axi_aresetn] \
  [get_bd_pins net_wrapper_0/logic_rstn] [get_bd_pins axis_dwidth_converter_0/aresetn] \
  [get_bd_pins pulse_gen_wrapper_0/aresetn] [get_bd_pins jesd_to_axi4s_0/aresetn]
connect_bd_net -net microblaze_riscv_0_Clk [get_bd_pins sysclk_wiz/mhz25] \
  [get_bd_pins xxv_ethernet_0/dclk] [get_bd_pins vio_eth/clk] [get_bd_pins xxv_ethernet_0/gt_drpclk_0] \
  [get_bd_pins xxv_ethernet_0/gt_drpclk_1] [get_bd_pins eth_wdt_0/dclk] [get_bd_pins jesd204_phy_0/drpclk]
connect_bd_net [get_bd_pins net_wrapper_0/ip_rx_busy] [get_bd_pins vio_rx/probe_in3]
connect_bd_net [get_bd_pins net_wrapper_0/ip_tx_busy] [get_bd_pins vio_rx/probe_in2]
connect_bd_net [get_bd_pins net_wrapper_0/rx_error_bad_fcs] [get_bd_pins vio_rx/probe_in4]
connect_bd_net [get_bd_pins net_wrapper_0/rx_error_bad_frame] [get_bd_pins vio_rx/probe_in5]
connect_bd_net [get_bd_pins net_wrapper_0/udp_rx_busy] [get_bd_pins vio_rx/probe_in1]
connect_bd_net [get_bd_pins net_wrapper_0/udp_rx_tdata] [get_bd_pins ila_udp/probe0]
connect_bd_net [get_bd_pins net_wrapper_0/udp_rx_tkeep] [get_bd_pins ila_udp/probe1]
connect_bd_net [get_bd_pins net_wrapper_0/udp_rx_tlast] [get_bd_pins ila_udp/probe2]
connect_bd_net [get_bd_pins net_wrapper_0/udp_rx_tready] [get_bd_pins ila_udp/probe4]
connect_bd_net [get_bd_pins net_wrapper_0/udp_rx_tvalid] [get_bd_pins ila_udp/probe3]
connect_bd_net [get_bd_pins net_wrapper_0/udp_tx_busy] [get_bd_pins vio_rx/probe_in0]
connect_bd_net [get_bd_pins net_wrapper_0/udp_tx_tdata] [get_bd_pins ila_udp/probe5]
connect_bd_net [get_bd_pins net_wrapper_0/udp_tx_tkeep] [get_bd_pins ila_udp/probe6]
connect_bd_net [get_bd_pins net_wrapper_0/udp_tx_tlast] [get_bd_pins ila_udp/probe7]
connect_bd_net [get_bd_pins net_wrapper_0/udp_tx_tready] [get_bd_pins ila_udp/probe9]
connect_bd_net [get_bd_pins net_wrapper_0/udp_tx_tvalid] [get_bd_pins ila_udp/probe8]
connect_bd_net [get_bd_pins net_wrapper_0/xgmii_txc] [get_bd_pins xxv_ethernet_0/tx_mii_c_1]
connect_bd_net [get_bd_pins net_wrapper_0/xgmii_txd] [get_bd_pins xxv_ethernet_0/tx_mii_d_1]
connect_bd_net [get_bd_pins pulse_gen_wrapper_0/eol_pulse] [get_bd_pins pulse_sync_eol/in_pulse] [get_bd_pins ila_pulser/probe4]
connect_bd_net [get_bd_pins pulse_gen_wrapper_0/sof_pulse] [get_bd_pins pulse_sync_sof/in_pulse] [get_bd_pins ila_pulser/probe5]
connect_bd_net -net pulse_gen_wrapper_0_start_pulse [get_bd_pins pulse_gen_wrapper_0/sol_pulse] \
  [get_bd_pins pulse_sync_sol/in_pulse] [get_bd_pins ila_pulser/probe3]
connect_bd_net -net pulse_gen_wrapper_1_pulser_neg [get_bd_pins pulse_gen_wrapper_0/pulser_neg] \
  [get_bd_ports pulser_neg_0] [get_bd_pins ila_pulser/probe0]
connect_bd_net -net pulse_gen_wrapper_1_pulser_oen [get_bd_pins pulse_gen_wrapper_0/pulser_oen] \
  [get_bd_ports pulser_oen_0] [get_bd_pins ila_pulser/probe2]
connect_bd_net -net pulse_gen_wrapper_1_pulser_pos [get_bd_pins pulse_gen_wrapper_0/pulser_pos] \
  [get_bd_ports pulser_pos_0] [get_bd_pins ila_pulser/probe1]
connect_bd_net [get_bd_pins pulse_sync_eol/out_pulse] [get_bd_pins ila_framing/probe3] [get_bd_pins jesd_to_axi4s_0/us_eol]
connect_bd_net [get_bd_pins pulse_sync_sof/out_pulse] [get_bd_pins ila_framing/probe4] [get_bd_pins jesd_to_axi4s_0/us_sof]
connect_bd_net [get_bd_pins pulse_sync_sol/out_pulse] [get_bd_pins ila_framing/probe2] [get_bd_pins jesd_to_axi4s_0/us_sol]
connect_bd_net -net qpllreset [get_bd_pins vio_eth/probe_out7] [get_bd_pins xxv_ethernet_0/qpllreset_in_0]
connect_bd_net -net remote_ip [get_bd_pins vio_rx/probe_out7] [get_bd_pins vio_rx/probe_in9] [get_bd_pins net_wrapper_0/remote_ip]
connect_bd_net -net reset_rx_datapath0 [get_bd_pins vio_eth/probe_out2] [get_bd_pins xxv_ethernet_0/gtwiz_reset_rx_datapath_0]
connect_bd_net -net reset_rx_datapath1 [get_bd_pins vio_eth/probe_out13] [get_bd_pins xxv_ethernet_0/gtwiz_reset_rx_datapath_1]
connect_bd_net -net reset_tx_datapath1 [get_bd_pins vio_eth/probe_out12] [get_bd_pins xxv_ethernet_0/gtwiz_reset_tx_datapath_1]
connect_bd_net -net rx_reset [get_bd_pins vio_eth/probe_out5] [get_bd_pins xxv_ethernet_0/rx_reset_0]
connect_bd_net -net rx_reset1 [get_bd_pins vio_eth/probe_out11] [get_bd_pins xxv_ethernet_0/rx_reset_1]
connect_bd_net -net rx_reset_gt [get_bd_pins jesd204b_rx_0/rx_reset_gt] \
  [get_bd_pins jesd204_phy_0/rx_reset_gt] [get_bd_pins vio_0/probe_in4] [get_bd_pins ila_jesd/probe11]
connect_bd_net -net rx_rst [get_bd_pins vio_rx/probe_out0] [get_bd_pins net_wrapper_0/xgmii_rx_rst]
connect_bd_net -net rxn_in_1_1 [get_bd_ports jesd_rxn] [get_bd_pins jesd204_phy_0/rxn_in]
connect_bd_net -net rxp_in_1_1 [get_bd_ports jesd_rxp] [get_bd_pins jesd204_phy_0/rxp_in]
connect_bd_net [get_bd_ports sfp_mod_abs] [get_bd_pins vio_eth/probe_in15]
connect_bd_net -net skip_serialize [get_bd_pins vio_0/probe_out4] [get_bd_pins jesd_to_axi4s_0/skip]
connect_bd_net [get_bd_pins slice_adcrst/Dout] [get_bd_ports adc_rst]
connect_bd_net [get_bd_pins slice_jdestrxrst/Dout] [get_bd_pins jesd204b_rx_0/rst_n]
connect_bd_net [get_bd_pins slice_jesdrst/Dout] [get_bd_pins jesd204_phy_0/rx_sys_reset] [get_bd_pins jesd204_phy_0/tx_sys_reset]
connect_bd_net -net subnet_mask [get_bd_pins vio_rx/probe_out5] [get_bd_pins vio_rx/probe_in8] [get_bd_pins net_wrapper_0/subnet_mask]
connect_bd_net -net syncoverride [get_bd_pins vio_0/probe_out1] [get_bd_ports syncoverride]
connect_bd_net -net sys_reset [get_bd_pins vio_eth/probe_out4] [get_bd_pins xxv_ethernet_0/sys_reset]
connect_bd_net [get_bd_pins sysclk_wiz/mhz10] [get_bd_ports mhz10] [get_bd_pins axi_quad_spi_0/ext_spi_clk] [get_bd_pins axi_quad_spi_1/ext_spi_clk]
connect_bd_net -net tx_reset [get_bd_pins vio_eth/probe_out6] [get_bd_pins xxv_ethernet_0/tx_reset_1]
connect_bd_net -net tx_reset_gt [get_bd_pins vio_0/probe_out0] [get_bd_pins jesd204_phy_0/tx_reset_gt]
connect_bd_net -net tx_rst [get_bd_pins vio_tx/probe_out0] [get_bd_pins net_wrapper_0/xgmii_tx_rst]
connect_bd_net -net txdiffctrl [get_bd_pins vio_eth/probe_out14] [get_bd_pins xxv_ethernet_0/gt_txdiffctrl_1]
connect_bd_net -net txpolarity [get_bd_pins vio_eth/probe_out0] [get_bd_pins xxv_ethernet_0/gt_txpolarity_1]
connect_bd_net -net txpostcursor [get_bd_pins vio_eth/probe_out3] [get_bd_pins xxv_ethernet_0/gt_txpostcursor_1]
connect_bd_net -net txprecursor [get_bd_pins vio_eth/probe_out8] [get_bd_pins xxv_ethernet_0/gt_txprecursor_1]
connect_bd_net -net txreset0 [get_bd_pins vio_eth/probe_out9] [get_bd_pins xxv_ethernet_0/tx_reset_0]
connect_bd_net [get_bd_pins util_ds_buf_0/IBUF_DS_ODIV2] [get_bd_pins util_ds_buf_1/BUFG_GT_I]
connect_bd_net [get_bd_pins util_ds_buf_0/IBUF_OUT] [get_bd_pins jesd204_phy_0/cpll_refclk]
connect_bd_net -net util_ds_buf_1_BUFGCE_O [get_bd_pins jesd_coreclk_buf/IBUF_OUT] \
  [get_bd_pins jesd204_phy_0/tx_core_clk] [get_bd_pins jesd204_phy_0/rx_core_clk] [get_bd_pins c_counter_binary_0/CLK] \
  [get_bd_pins vio_0/clk] [get_bd_pins ila_jesd/clk] [get_bd_pins jesd204b_rx_0/clk] \
  [get_bd_pins axis_data_fifo_0/s_axis_aclk] [get_bd_pins ila_framing/clk] [get_bd_pins jesd_to_axi4s_0/aclk] \
  [get_bd_pins pulse_sync_sol/out_clk] [get_bd_pins pulse_sync_sof/out_clk] [get_bd_pins pulse_sync_eol/out_clk]
connect_bd_net [get_bd_pins util_ds_buf_1/BUFG_GT_O] [get_bd_pins c_counter_binary_1/CLK]
connect_bd_net [get_bd_pins vio_eth/probe_out10] [get_bd_pins xxv_ethernet_0/gt_loopback_in_0]
connect_bd_net -net wdt_disable0 [get_bd_pins vio_eth/probe_out17] [get_bd_pins xxv_ethernet_0/ctl_rx_wdt_disable_0]
connect_bd_net -net wdt_disable1 [get_bd_pins vio_eth/probe_out18] [get_bd_pins xxv_ethernet_0/ctl_rx_wdt_disable_1]
connect_bd_net [get_bd_pins xxv_ethernet_0/gt_txbufstatus_1] [get_bd_pins vio_eth/probe_in14]
connect_bd_net [get_bd_pins xxv_ethernet_0/gt_txresetdone_1] [get_bd_pins vio_eth/probe_in18] [get_bd_pins eth_wdt_0/tx_reset_done]
connect_bd_net [get_bd_pins xxv_ethernet_0/gtpowergood_out_0] [get_bd_pins vio_eth/probe_in10]
connect_bd_net [get_bd_pins xxv_ethernet_0/rx_clk_out_0] \
  [get_bd_pins xxv_ethernet_0/rx_core_clk_0] [get_bd_pins vio_rx/clk] [get_bd_pins axi_gpio_0/s_axi_aclk] \
  [get_bd_pins smartconnect_0/aclk] [get_bd_pins ila_2/clk] [get_bd_pins xfcp_fanout_wrapper_0/aclk] \
  [get_bd_pins axi_gpio_rst/s_axi_aclk] [get_bd_pins axi_quad_spi_0/s_axi_aclk] [get_bd_pins axi_quad_spi_1/s_axi_aclk] \
  [get_bd_pins axi_gpio_pinswap/s_axi_aclk] [get_bd_pins spi_ila_wrapper_0/clk] [get_bd_pins axis_data_fifo_0/m_axis_aclk] \
  [get_bd_pins jesd204_phy_0/s_axi_aclk] [get_bd_pins ila_udp/clk] [get_bd_pins net_wrapper_0/logic_clk] \
  [get_bd_pins net_wrapper_0/xgmii_rx_clk] [get_bd_pins axis_dwidth_converter_0/aclk] [get_bd_pins pulse_gen_wrapper_0/aclk] \
  [get_bd_pins pulse_sync_sol/in_clk] [get_bd_pins pulse_sync_sof/in_clk] [get_bd_pins pulse_sync_eol/in_clk] \
  [get_bd_pins ila_pulser/clk]
connect_bd_net [get_bd_pins xxv_ethernet_0/rx_clk_out_1] [get_bd_pins xxv_ethernet_0/rx_core_clk_1]
connect_bd_net [get_bd_pins xxv_ethernet_0/rx_mii_c_0] [get_bd_pins net_wrapper_0/xgmii_rxc]
connect_bd_net [get_bd_pins xxv_ethernet_0/rx_mii_d_0] [get_bd_pins net_wrapper_0/xgmii_rxd]
connect_bd_net [get_bd_pins xxv_ethernet_0/stat_rx_bad_code_0] [get_bd_pins vio_eth/probe_in1]
connect_bd_net [get_bd_pins xxv_ethernet_0/stat_rx_bad_code_valid_0] [get_bd_pins vio_eth/probe_in2]
connect_bd_net [get_bd_pins xxv_ethernet_0/stat_rx_block_lock_0] [get_bd_pins vio_eth/probe_in3]
connect_bd_net [get_bd_pins xxv_ethernet_0/stat_rx_error_0] [get_bd_pins vio_eth/probe_in4]
connect_bd_net [get_bd_pins xxv_ethernet_0/stat_rx_error_valid_0] [get_bd_pins vio_eth/probe_in5]
connect_bd_net [get_bd_pins xxv_ethernet_0/stat_rx_fifo_error_0] [get_bd_pins vio_eth/probe_in6]
connect_bd_net [get_bd_pins xxv_ethernet_0/stat_rx_framing_err_0] [get_bd_pins vio_eth/probe_in7]
connect_bd_net [get_bd_pins xxv_ethernet_0/stat_rx_framing_err_valid_0] [get_bd_pins vio_eth/probe_in8]
connect_bd_net [get_bd_pins xxv_ethernet_0/stat_rx_hi_ber_0] [get_bd_pins vio_eth/probe_in11]
connect_bd_net [get_bd_pins xxv_ethernet_0/stat_rx_local_fault_0] [get_bd_pins vio_eth/probe_in12]
connect_bd_net [get_bd_pins xxv_ethernet_0/stat_rx_status_0] [get_bd_pins vio_eth/probe_in16]
connect_bd_net [get_bd_pins xxv_ethernet_0/stat_rx_valid_ctrl_code_0] [get_bd_pins vio_eth/probe_in13]
connect_bd_net [get_bd_pins xxv_ethernet_0/stat_tx_local_fault_1] [get_bd_pins vio_eth/probe_in0]
connect_bd_net [get_bd_pins xxv_ethernet_0/user_rx_reset_0] \
  [get_bd_pins ilvector_logic_1/Op1] [get_bd_pins vio_eth/probe_in19] [get_bd_pins eth_wdt_0/user_rx_reset]
connect_bd_net [get_bd_pins xxv_ethernet_0/user_tx_reset_1] [get_bd_pins vio_eth/probe_in9]

# ---- address map ----
assign_bd_address -offset 0x00000000 -range 64K -target_address_space [get_bd_addr_spaces xfcp_fanout_wrapper_0/m_axi] [get_bd_addr_segs axi_gpio_0/S_AXI/Reg]
assign_bd_address -offset 0x00010000 -range 64K -target_address_space [get_bd_addr_spaces xfcp_fanout_wrapper_0/m_axi] [get_bd_addr_segs axi_gpio_rst/S_AXI/Reg]
assign_bd_address -offset 0x00020000 -range 64K -target_address_space [get_bd_addr_spaces xfcp_fanout_wrapper_0/m_axi] [get_bd_addr_segs pulse_gen_wrapper_0/S_AXI/reg0]
assign_bd_address -offset 0x00030000 -range 64K -target_address_space [get_bd_addr_spaces xfcp_fanout_wrapper_0/m_axi] [get_bd_addr_segs jesd204_phy_0/s_axi/Reg]
assign_bd_address -offset 0x00040000 -range 64K -target_address_space [get_bd_addr_spaces xfcp_fanout_wrapper_0/m_axi] [get_bd_addr_segs axi_quad_spi_0/AXI_LITE/Reg]
assign_bd_address -offset 0x00050000 -range 64K -target_address_space [get_bd_addr_spaces xfcp_fanout_wrapper_0/m_axi] [get_bd_addr_segs axi_quad_spi_1/AXI_LITE/Reg]
assign_bd_address -offset 0x00060000 -range 64K -target_address_space [get_bd_addr_spaces xfcp_fanout_wrapper_0/m_axi] [get_bd_addr_segs axi_gpio_pinswap/S_AXI/Reg]

validate_bd_design
save_bd_design
